# EAGLE schematic Main board (EAGLE 9.6.2)
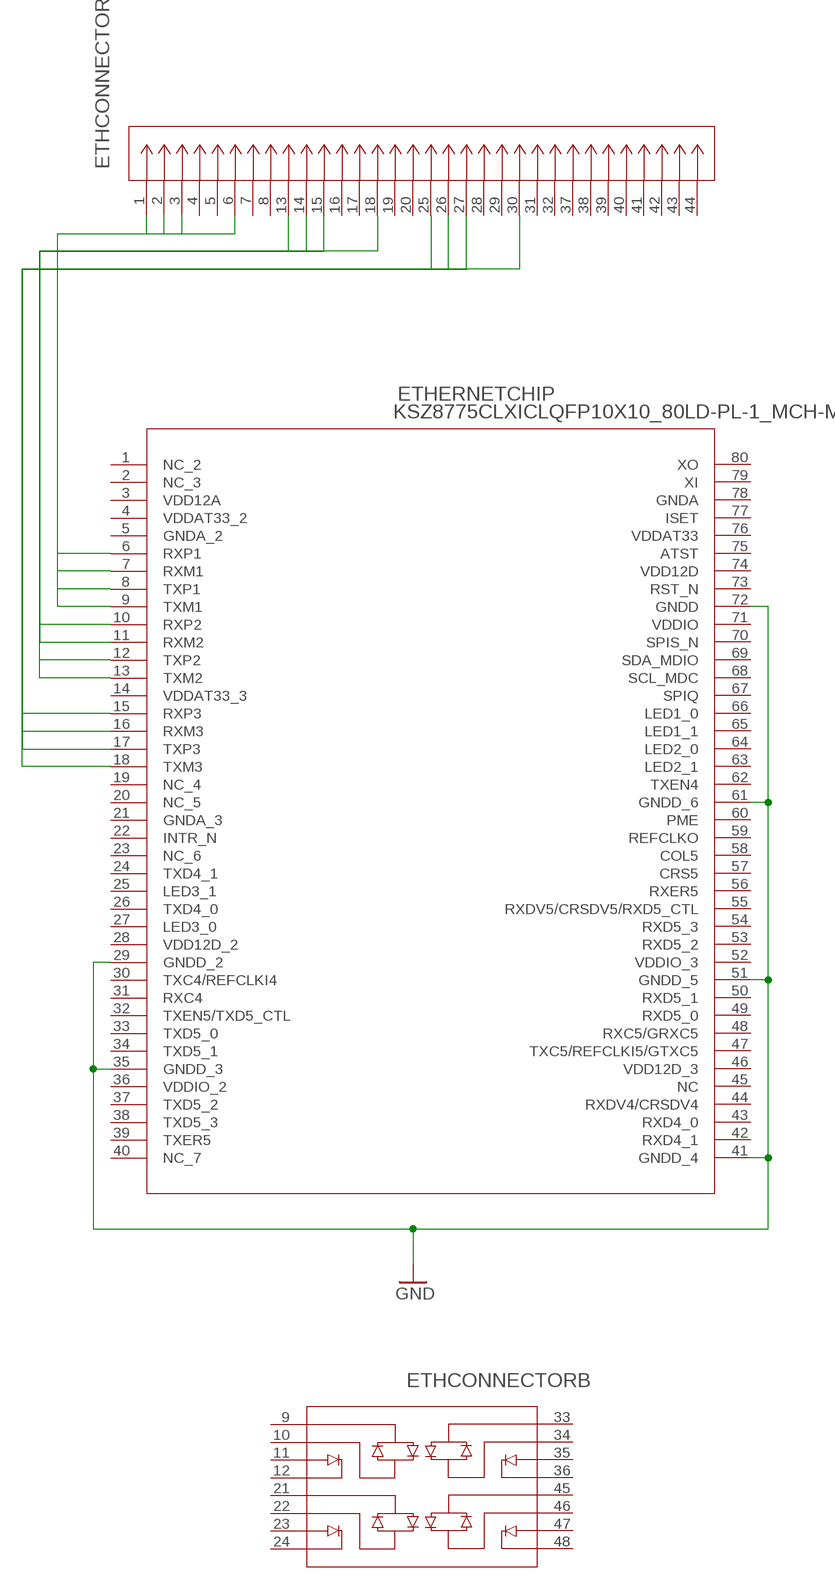
[diagram p0: schematic, sheet 1, part 1 of 2]
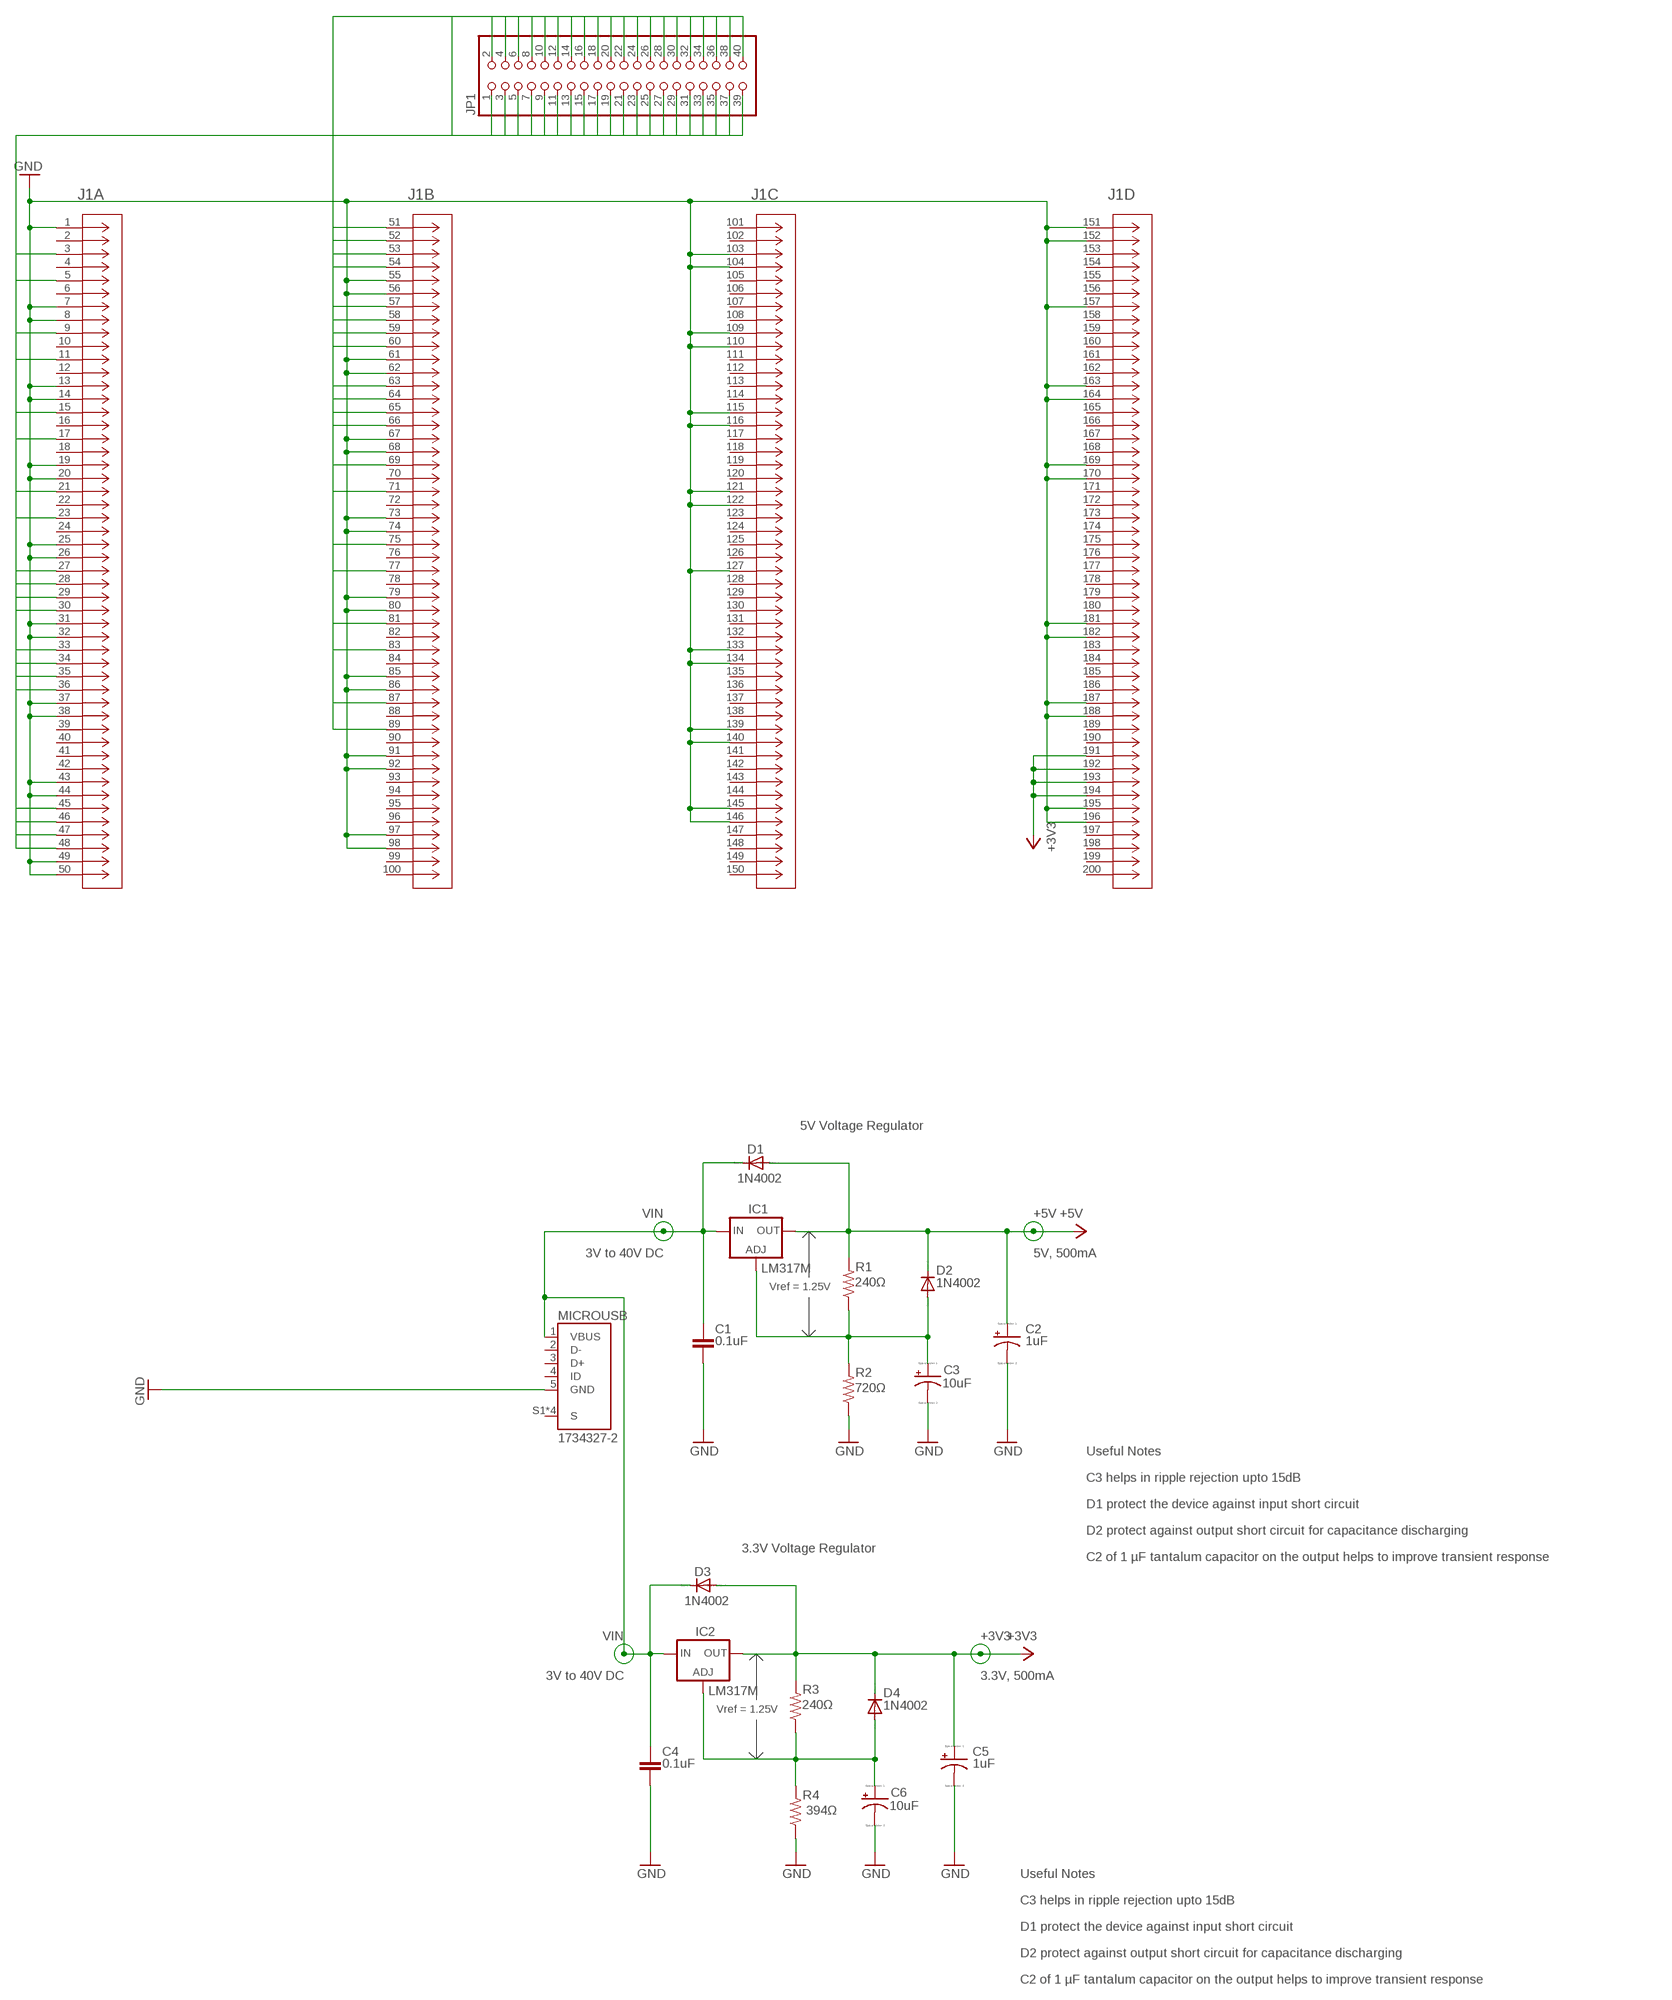
[diagram p1: schematic, sheet 1, part 2 of 2]

## Parts
C1  0.1uF  C-EU075-052X106  [C075-052X106]
C2  1uF  CPOL-US085CS-1AR  [085CS_1AR]
C3  10uF  CPOL-US085CS-1AR  [085CS_1AR]
C4  0.1uF  C-EU075-052X106  [C075-052X106]
C5  1uF  CPOL-US085CS-1AR  [085CS_1AR]
C6  10uF  CPOL-US085CS-1AR  [085CS_1AR]
D1  1N4002  1N4004  [DO41-10]
D2  1N4002  1N4004  [DO41-10]
D3  1N4002  1N4004  [DO41-10]
D4  1N4002  1N4004  [DO41-10]
ETHCONNECTOR  E5J88-032-01-L  [CONN_E5J88-032-01-L_PUL]
ETHERNETCHIP  KSZ8775CLXICLQFP10X10_80LD-PL-1_MCH-M  [LQFP10X10_80LD-PL-1_MCH-M]
IC1  LM317MBSTT3  [SOT223]
IC2  LM317MBSTT3  [SOT223]
J1  1473149-4  [CONN_1473149-4_TEC]
JP1  PINHD-2X20-BIG  [2X20-BIG]
MICROUSB  1734327-2  [TE_1734327-2]
R1  240Ω  R-US_M0805  [M0805]
R2  720Ω  R-US_M0805  [M0805]
R3  240Ω  R-US_M0805  [M0805]
R4  394Ω  R-US_M0805  [M0805]

## Nets
+3V3: C5.+ D3.A D4.C IC2.4(OUT) J1.191 J1.192 J1.193 J1.194 R3.2
+5V: C2.+ D1.A D2.C IC1.4(OUT) R1.2
GND: C1.2 C2.- C3.- C4.2 C5.- C6.- ETHERNETCHIP.29(GNDD_2) ETHERNETCHIP.35(GNDD_3) ETHERNETCHIP.41(GNDD_4) ETHERNETCHIP.51(GNDD_5) ETHERNETCHIP.61(GNDD_6) ETHERNETCHIP.72(GNDD) J1.1 J1.7 J1.8 J1.13 J1.14 J1.19 J1.20 J1.25 J1.26 J1.31 J1.32 J1.37 J1.38 J1.43 J1.44 J1.49 J1.50 J1.55 J1.56 J1.61 J1.62 J1.67 J1.68 J1.73 J1.74 J1.79 J1.80 J1.85 J1.86 J1.91 J1.92 J1.97 J1.98 J1.103 J1.104 J1.109 J1.110 J1.115 J1.116 J1.121 J1.122 J1.127 J1.133 J1.134 J1.139 J1.140 J1.145 J1.146 J1.151 J1.152 J1.157 J1.163 J1.164 J1.169 J1.170 J1.181 J1.182 J1.187 J1.188 J1.195 J1.196 MICROUSB.5(GND) R2.1 R4.1
GPIO0: J1.3 JP1.1
GPIO1: J1.5 JP1.2
GPIO2: J1.15 JP1.3
GPIO3: J1.11 JP1.4
GPIO4: JP1.5
GPIO5: J1.17 JP1.6
GPIO6: J1.21 JP1.7
GPIO7: J1.23 JP1.8
GPIO8: J1.27 JP1.9
GPIO9: J1.29 JP1.10
GPIO10: J1.45 JP1.11
GPIO11: J1.35 JP1.12
GPIO12: JP1.13
GPIO13: J1.47 JP1.14
GPIO14: J1.51 JP1.15
GPIO15: J1.53 JP1.16
GPIO16: J1.57 JP1.17
GPIO17: J1.59 JP1.18
GPIO18: J1.63 JP1.19
GPIO19: J1.65 JP1.20
GPIO20: J1.69 JP1.21
GPIO21: J1.71 JP1.22
GPIO22: J1.75 JP1.23
GPIO23: J1.77 JP1.24
GPIO24: J1.81 JP1.25
GPIO25: J1.83 JP1.26
GPIO26: J1.87 JP1.27
GPIO27: J1.89 JP1.28
GPIO28: J1.28 JP1.29
GPIO29: J1.30 JP1.30
GPIO30: J1.34 JP1.31
GPIO31: J1.36 JP1.32
GPIO32: J1.46 JP1.33
GPIO33: J1.48 JP1.34
GPIO34: J1.52 JP1.35
GPIO35: J1.54 JP1.36
GPIO36: J1.58 JP1.37
GPIO37: J1.60 JP1.38
GPIO38: J1.64 JP1.39
GPIO39: J1.66 JP1.40
N$1: C3.+ D2.A IC1.1(ADJ) R1.1 R2.2
N$3: C6.+ D4.A IC2.1(ADJ) R3.1 R4.2
N$5: J1.9
N$13: J1.33
RXM1: ETHCONNECTOR.6 ETHERNETCHIP.7(RXM1)
RXM2: ETHCONNECTOR.18 ETHERNETCHIP.11(RXM2)
RXM3: ETHCONNECTOR.30 ETHERNETCHIP.16(RXM3)
RXP1: ETHCONNECTOR.3 ETHCONNECTOR.32 ETHERNETCHIP.6(RXP1)
RXP2: ETHCONNECTOR.15 ETHERNETCHIP.10(RXP2)
RXP3: ETHCONNECTOR.27 ETHERNETCHIP.15(RXP3)
TXM1: ETHCONNECTOR.2 ETHERNETCHIP.9(TXM1)
TXM2: ETHCONNECTOR.14 ETHERNETCHIP.13(TXM2)
TXM3: ETHCONNECTOR.26 ETHERNETCHIP.18(TXM3)
TXP1: ETHCONNECTOR.1 ETHERNETCHIP.8(TXP1)
TXP2: ETHCONNECTOR.13 ETHERNETCHIP.12(TXP2)
TXP3: ETHCONNECTOR.25 ETHERNETCHIP.17(TXP3)
VIN: C1.1 C4.1 D1.C D3.C IC1.3(IN) IC2.3(IN) MICROUSB.1(VBUS)
Unconnected: ETHCONNECTOR.4 ETHCONNECTOR.5 ETHCONNECTOR.7 ETHCONNECTOR.8 ETHCONNECTOR.9 ETHCONNECTOR.10 ETHCONNECTOR.11 ETHCONNECTOR.12 ETHCONNECTOR.16 ETHCONNECTOR.17 ETHCONNECTOR.19 ETHCONNECTOR.20 ETHCONNECTOR.21 ETHCONNECTOR.22 ETHCONNECTOR.23 ETHCONNECTOR.24 ETHCONNECTOR.28 ETHCONNECTOR.29 ETHCONNECTOR.31 ETHCONNECTOR.33 ETHCONNECTOR.34 ETHCONNECTOR.35 ETHCONNECTOR.36 ETHCONNECTOR.37 ETHCONNECTOR.38 ETHCONNECTOR.39 ETHCONNECTOR.40 ETHCONNECTOR.41 ETHCONNECTOR.42 ETHCONNECTOR.43 ETHCONNECTOR.44 ETHCONNECTOR.45 ETHCONNECTOR.46 ETHCONNECTOR.47 ETHCONNECTOR.48 ETHERNETCHIP.1(NC_2) ETHERNETCHIP.2(NC_3) ETHERNETCHIP.5(GNDA_2) ETHERNETCHIP.19(NC_4) ETHERNETCHIP.20(NC_5) ETHERNETCHIP.21(GNDA_3) ETHERNETCHIP.22(INTR_N) ETHERNETCHIP.23(NC_6) ETHERNETCHIP.24(TXD4_1) ETHERNETCHIP.25(LED3_1) ETHERNETCHIP.26(TXD4_0) ETHERNETCHIP.27(LED3_0) ETHERNETCHIP.30(TXC4/REFCLKI4) ETHERNETCHIP.31(RXC4) ETHERNETCHIP.32(TXEN5/TXD5_CTL) ETHERNETCHIP.33(TXD5_0) ETHERNETCHIP.34(TXD5_1) ETHERNETCHIP.37(TXD5_2) ETHERNETCHIP.38(TXD5_3) ETHERNETCHIP.39(TXER5) ETHERNETCHIP.40(NC_7) ETHERNETCHIP.42(RXD4_1) ETHERNETCHIP.43(RXD4_0) ETHERNETCHIP.44(RXDV4/CRSDV4) ETHERNETCHIP.45(NC) ETHERNETCHIP.47(TXC5/REFCLKI5/GTXC5) ETHERNETCHIP.48(RXC5/GRXC5) ETHERNETCHIP.49(RXD5_0) ETHERNETCHIP.50(RXD5_1) ETHERNETCHIP.53(RXD5_2) ETHERNETCHIP.54(RXD5_3) ETHERNETCHIP.55(RXDV5/CRSDV5/RXD5_CTL) ETHERNETCHIP.56(RXER5) ETHERNETCHIP.57(CRS5) ETHERNETCHIP.58(COL5) ETHERNETCHIP.59(REFCLKO) ETHERNETCHIP.60(PME) ETHERNETCHIP.62(TXEN4) ETHERNETCHIP.63(LED2_1) ETHERNETCHIP.64(LED2_0) ETHERNETCHIP.65(LED1_1) ETHERNETCHIP.66(LED1_0) ETHERNETCHIP.67(SPIQ) ETHERNETCHIP.68(SCL_MDC) ETHERNETCHIP.69(SDA_MDIO) ETHERNETCHIP.70(SPIS_N) ETHERNETCHIP.73(RST_N) ETHERNETCHIP.75(ATST) ETHERNETCHIP.77(ISET) ETHERNETCHIP.78(GNDA) ETHERNETCHIP.79(XI) ETHERNETCHIP.80(XO) J1.2 J1.4 J1.6 J1.10 J1.12 J1.16 J1.18 J1.22 J1.24 J1.39 J1.40 J1.41 J1.42 J1.70 J1.72 J1.76 J1.78 J1.82 J1.84 J1.88 J1.90 J1.93 J1.94 J1.95 J1.96 J1.99 J1.100 J1.101 J1.102 J1.105 J1.106 J1.107 J1.108 J1.111 J1.112 J1.113 J1.114 J1.117 J1.118 J1.119 J1.120 J1.123 J1.124 J1.125 J1.126 J1.128 J1.129 J1.130 J1.131 J1.132 J1.135 J1.136 J1.137 J1.138 J1.141 J1.142 J1.143 J1.144 J1.147 J1.148 J1.149 J1.150 J1.153 J1.154 J1.155 J1.156 J1.158 J1.159 J1.160 J1.161 J1.162 J1.165 J1.166 J1.167 J1.168 J1.171 J1.172 J1.173 J1.174 J1.175 J1.176 J1.177 J1.178 J1.179 J1.180 J1.183 J1.184 J1.185 J1.186 J1.189 J1.190 J1.197 J1.198 J1.199 J1.200 MICROUSB.2(D-) MICROUSB.3(D+) MICROUSB.4(ID)

## Notes on the sheet
- 5V Voltage Regulator
- 3V to 40V DC | 5V, 500mA
- Vref = 1.25V
- Useful Notes
- C3 helps in ripple rejection upto 15dB
- D1 protect the device against input short circuit
- D2 protect against output short circuit for capacitance discharging
- 3.3V Voltage Regulator
- C2 of 1 µF tantalum capacitor on the output helps to improve transient response
- 3V to 40V DC | 3.3V, 500mA
- Vref = 1.25V
- Useful Notes
- C3 helps in ripple rejection upto 15dB
- D1 protect the device against input short circuit
- D2 protect against output short circuit for capacitance discharging
- C2 of 1 µF tantalum capacitor on the output helps to improve transient response

## Power pins joined to a net without a drawn wire
S: MICROUSB.S1(S) MICROUSB.S2(S) MICROUSB.S3(S) MICROUSB.S4(S)
VDD12A: ETHERNETCHIP.3(VDD12A)
VDD12D: ETHERNETCHIP.74(VDD12D)
VDD12D_2: ETHERNETCHIP.28(VDD12D_2)
VDD12D_3: ETHERNETCHIP.46(VDD12D_3)
VDDAT33: ETHERNETCHIP.76(VDDAT33)
VDDAT33_2: ETHERNETCHIP.4(VDDAT33_2)
VDDAT33_3: ETHERNETCHIP.14(VDDAT33_3)
VDDIO: ETHERNETCHIP.71(VDDIO)
VDDIO_2: ETHERNETCHIP.36(VDDIO_2)
VDDIO_3: ETHERNETCHIP.52(VDDIO_3)

## Library data of the parts
C1 C4 = rcl:C-EU: CAPACITOR, European symbol
C2 C3 C5 C6 = resistor:CPOL-US: POLARIZED CAPACITOR, American symbol
D1-D4 = diode:1N4004: DIODE general purpose rectifier, 1 A
ETHCONNECTOR = connector lib:E5J88-032-01-L; BUILT_BY: EMA_Cory; COPYRIGHT: Copyright (C) 2018 Accelerated Designs. All rights reserved; DATASHEET: https://productfinder.pulseeng.com/doc_type/WEB301/doc_num/E5J88-032-01-L/doc_part/E5J88-032-01-L.pdf; MANUFACTURER_PART_NUMBER: E5J88-032-01-L; SOURCELIBRARY: Pulse_Electronics_Corporation_2020-06-15; VENDOR: Pulse Electronics Corporation
ETHERNETCHIP = library:KSZ8775CLXIC; BUILT_BY: EMA_Cory; COPYRIGHT: Copyright (C) 2018 Accelerated Designs. All rights reserved; DATASHEET: https://ww1.microchip.com/downloads/en/DeviceDoc/00002129C.pdf; MANUFACTURER_PART_NUMBER: KSZ8775CLXIC; SOURCELIBRARY: Add_to_database_2020-12-23; VENDOR: Microchip
IC1 IC2 = v-reg:LM317?*: 500 mA Adjustable Output Positive Voltage Regulator Source: http://www.onsemi.co.jp .. LM317M-D.PDF; PARTNUMBER: LM317M
J1 = ddr2 SODIMM:1473149-4; BUILT_BY: EMA_Cory; COPYRIGHT: Copyright (C) 2018 Accelerated Designs. All rights reserved; DATASHEET: https://www.te.com/commerce/DocumentDelivery/DDEController?Action=srchrtrv&DocNm=1473149&DocType=Customer+Drawing&DocLang=English; MANUFACTURER_PART_NUMBER: 1473149-4; SOURCELIBRARY: TE_Connectivity_2020-02-21; VENDOR: TE Connectivity
JP1 = adafruit:PINHD-2X20: PIN HEADER
MICROUSB = mini a usb:1734327-2: USB - mini A USB 2.0 Receptacle Connector 5 Position Surface Mount, Right Angle; COMMENT: 1734327-2; DESCRIPTION: Conn USB Type A RCP 5 POS 0.8mm Solder RA SMD 5 Terminal 1 Port T/R; DIGI-KEY_PART_NUMBER: A111051CT-ND; EU_ROHS_COMPLIANCE: Compliant; MF: TE Connectivity; MP: 1734327-2; PACKAGE: None; PURCHASE-URL: https://pricing.snapeda.com/search/part/1734327-2/?ref=eda
R1-R4 = resistor:R-US_: RESISTOR, American symbol